# Altium schematic sheet PAGE14.SchDoc
size 246 x 182 mm
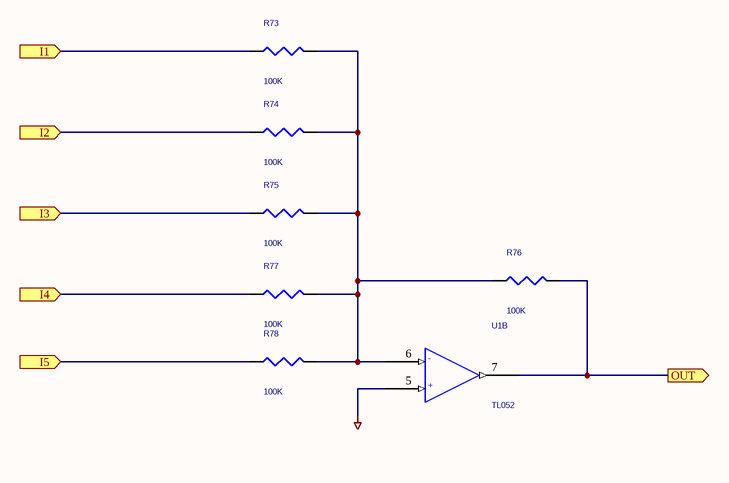
[diagram p0: PAGE14.SchDoc]

## Parts
R73  100K  [AXIAL0.4]
R74  100K  [AXIAL0.4]
R75  100K  [AXIAL0.4]
R76  100K  [AXIAL0.4]
R77  100K  [AXIAL0.4]
R78  100K  [AXIAL0.4]
U1  TL052  [DIP8]  (part B of 3)

## Ports
I1 (in), I2 (in), I3 (in), I4 (in), I5 (in), OUT (out)

## Nets
AGND: U1.5(+)
I1: R73.1 ; port I1
I2: R74.1 ; port I2
I3: R75.1 ; port I3
I4: R77.1 ; port I4
I5: R78.1 ; port I5
OUT: R76.2 U1.7(OUT) ; port OUT
NetR73_2: R73.2 R74.2 R75.2 R76.1 R77.2 R78.2 U1.6(-)

## Library data of the parts
R73-R78 = R_Dup1: MOUSER PN: 271-100K-RC
U1 = GEN DUAL OPAMP-H: PACKAGE: ATNM1MIX